# EAGLE schematic main (EAGLE 7.5.0)
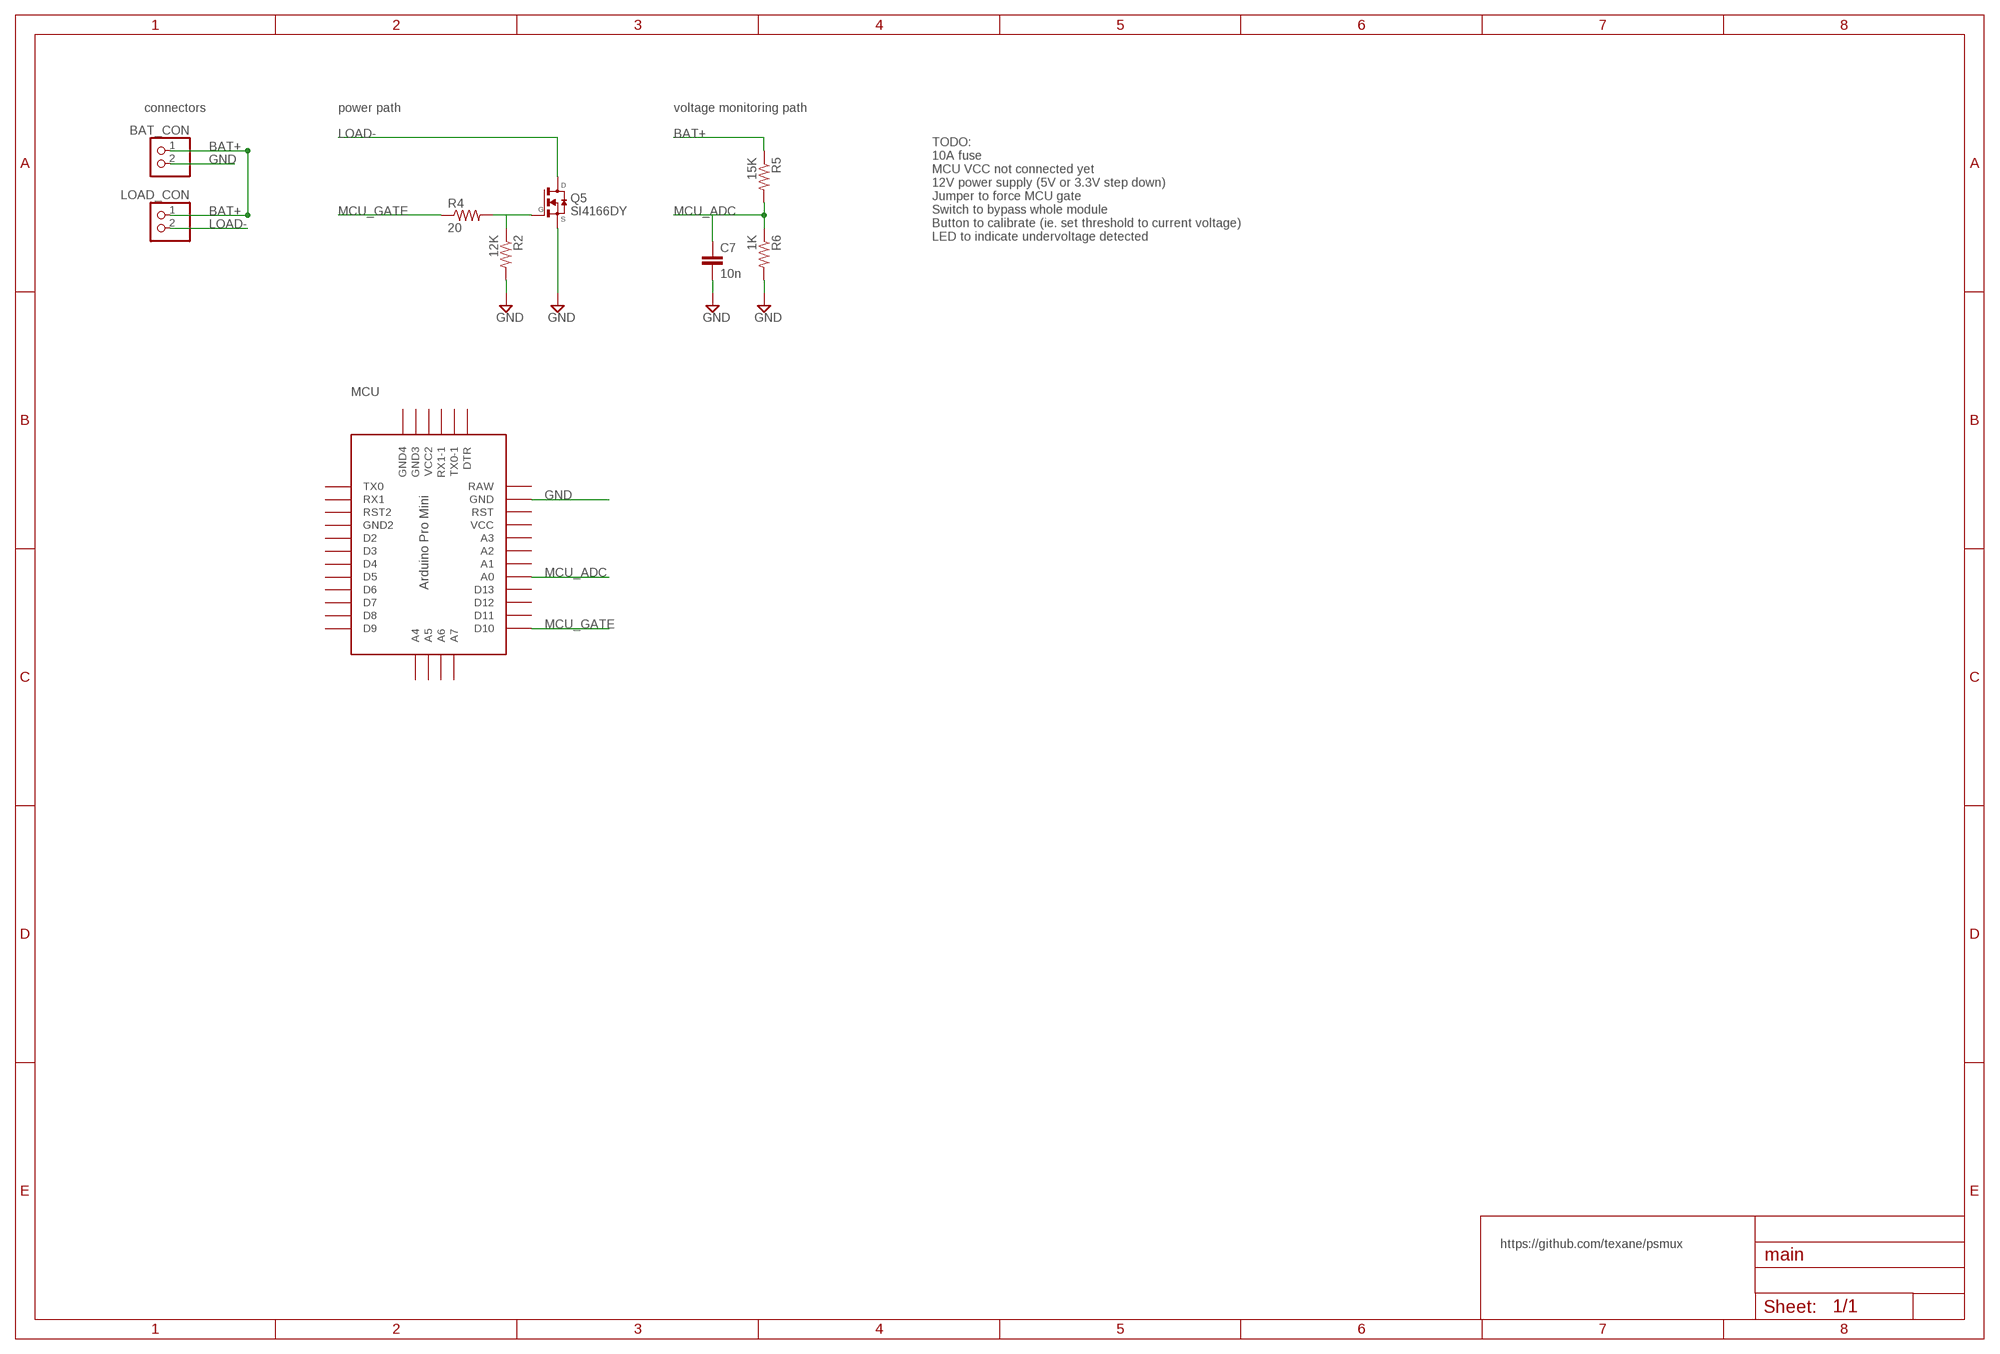
[diagram p0: schematic, sheet 1]

## Parts
BAT_CON  PINHD-1X2  [1X02]
C7  10n  C-EUC0805K  [C0805K]
LOAD_CON  PINHD-1X2  [1X02]
Q5  SI4840DY  [SO08-E3]
R2  12K  R-US_M0805  [M0805]
R4  20  R-US_M0805  [M0805]
R5  15K  R-US_M0805  [M0805]
R6  1K  R-US_M0805  [M0805]
U$1  PRO-MINI  [PRO-MINI]

## Nets
BAT+: BAT_CON.1 LOAD_CON.1 R5.1
GND: BAT_CON.2 C7.2 Q5.1-3(S) R2.2 R6.2 U$1.GND
LOAD-: LOAD_CON.2 Q5.5-8(D)
MCU_ADC: C7.1 R5.2 R6.1 U$1.A0
MCU_GATE: R4.1 U$1.D10
N$1: Q5.4(G) R2.1 R4.2
Unconnected: U$1.A1 U$1.A2 U$1.A3 U$1.A4 U$1.A5 U$1.A6 U$1.A7 U$1.D2 U$1.D3 U$1.D4 U$1.D5 U$1.D6 U$1.D7 U$1.D8 U$1.D9 U$1.D11 U$1.D12 U$1.D13 U$1.DTR U$1.GND1(GND2) U$1.GND2(GND4) U$1.GND3 U$1.RST U$1.RST1(RST2) U$1.RX1 U$1.RX1-1 U$1.TX0 U$1.TX0-1 U$1.VCC U$1.VCC1(VCC2)

## Notes on the sheet
- connectors | power path | voltage monitoring path
- SI4166DY
- TODO:
  10A fuse
  MCU VCC not connected yet
  12V power supply (5V or 3.3V step down)
  Jumper to force MCU gate
  Switch to bypass whole module
  Button to calibrate (ie. set threshold to current voltage)
  LED to indicate undervoltage detected
- MCU
- https://github.com/texane/psmux

## Power pins joined to a net without a drawn wire
RAW: U$1.RAW

## Library data of the parts
BAT_CON LOAD_CON = pinhead:PINHD-1X2: PIN HEADER
C7 = rcl:C-EU: CAPACITOR, European symbol
Q5 = transistor-fet:SI4840DY: N-Channel MOSFET
R2 R4-R6 = resistor:R-US_: RESISTOR, American symbol
U$1 = Arduino-clone:PRO-MINI: Arduion Pro Mini Clone V1.0 www.betemcu.cu